# Altium schematic sheet Carrier Cancellation Circuit.SchDoc
size A4; SheetNumber: 4; SheetTotal: 10
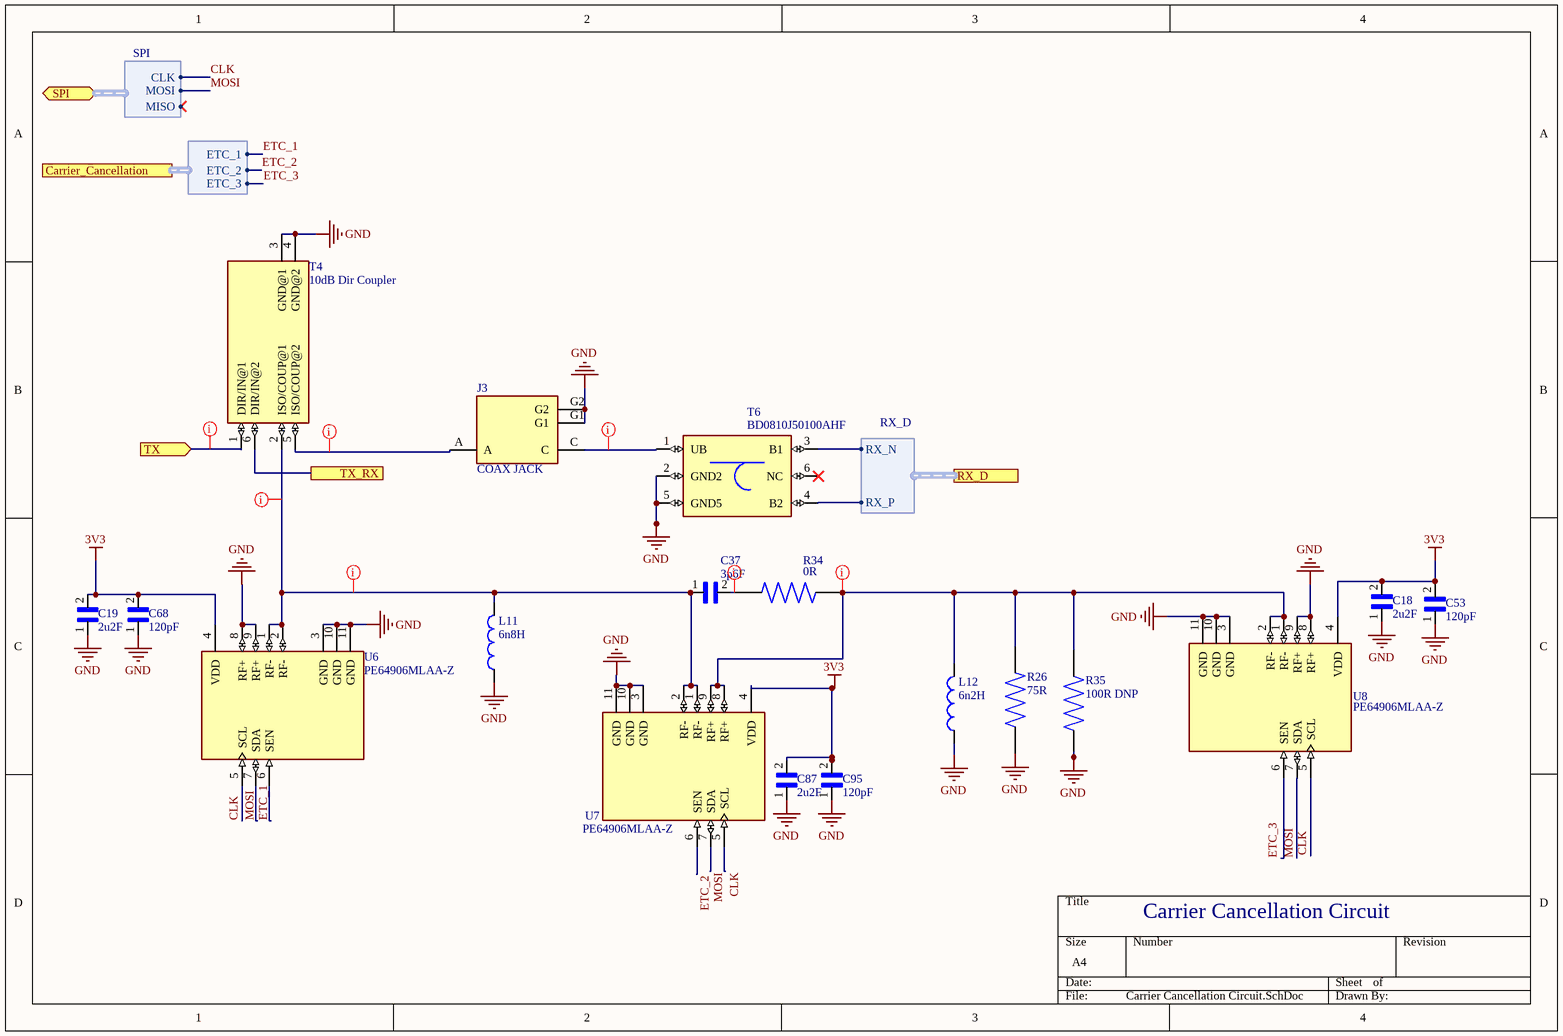
[diagram p0: Carrier Cancellation Circuit.SchDoc]

## Parts
C18  2u2F  [CAPC0603X35N]
C19  2u2F  [CAPC0603X35N]
C37  3p6F  [CAPC1005X55N]
C53  120pF  [CAPC0603X33N]
C68  120pF  [CAPC0603X33N]
C87  2u2F  [CAPC0603X35N]
C95  120pF  [CAPC0603X33N]
J3  COAX JACK  [SW_MS-156HF(01)]
L11  6n8H  [INDC1006X60N]
L12  6n2H  [INDC1006X60N]
R26  75R  [RES_ERJ2RKF75R0X]
R34  0R  [RESC1005X37N]
R35  100R DNP  [RES_ERJ2RKF75R0X]
T4  10dB Dir Coupler  [PSON65P164X204X84-6N]
T6  BD0810J50100AHF  [BD0810J50100AHF]
U6  PE64906MLAA-Z  [QFN50P200X200X60-11N]
U7  PE64906MLAA-Z  [QFN50P200X200X60-11N]
U8  PE64906MLAA-Z  [QFN50P200X200X60-11N]

## Ports
Carrier_Cancellation (harness Carrier_Cancellation, see System Overview[3A], External interfaces and connections[1A], Microcontroller[4B]), RX_D (harness RX_D, see System Overview[3A], UHF RFID READER IC[1D]), SPI (bidir, harness SPI, see System Overview[3A], External interfaces and connections[1A], Microcontroller[4A], UHF RFID READER IC[1A]), TX (in, see System Overview[3A], External Power Amplifier[4B]), TX_RX (see System Overview[3A], Antenna Switch[3B])

## Harnesses
SPI: CLK, MISO, MOSI
Carrier_Cancellation: ETC_1, ETC_2, ETC_3
RX_D: RX_N, RX_P

## Nets
3V3: C18.2 C19.2 C53.2 C68.2 C87.2 C95.2 U6.4(VDD) U7.4(VDD) U8.4(VDD)
GND: C18.1 C19.1 C53.1 C68.1 C87.1 C95.1 J3.G1 J3.G2 L11.1 L12.1 R26.1 R35.1 T4.3(GND@1) T4.4(GND@2) T6.2(GND2) T6.5(GND5) U6.3(GND) U6.8(RF+) U6.9(RF+) U6.10(GND) U6.11(GND) U7.3(GND) U7.10(GND) U7.11(GND) U8.3(GND) U8.8(RF+) U8.9(RF+) U8.10(GND) U8.11(GND)
CLK: U6.5(SCL) U7.5(SCL) U8.5(SCL) ; port SPI.CLK
ETC_1: U6.6(SEN) ; port Carrier_Cancellation.ETC_1
ETC_2: U7.6(SEN) ; port Carrier_Cancellation.ETC_2
ETC_3: U8.6(SEN) ; port Carrier_Cancellation.ETC_3
MOSI: U6.7(SDA) U7.7(SDA) U8.7(SDA) ; port SPI.MOSI
TX: T4.1(DIR/IN@1) ; port TX
TX_RX: T4.6(DIR/IN@2) ; port TX_RX
NetC37_1: C37.1 L11.2 T4.2(ISO/COUP@1) U6.1(RF-) U6.2(RF-) U7.1(RF-) U7.2(RF-)
NetC37_2: C37.2 R34.1
NetJ3_A: J3.A T4.5(ISO/COUP@2)
NetJ3_C: J3.C T6.1(UB)
NetL12_2: L12.2 R26.2 R34.2 R35.2 U7.8(RF+) U7.9(RF+) U8.1(RF-) U8.2(RF-)
NetT6_3: T6.3(B1) ; port RX_D.RX_N
NetT6_4: T6.4(B2) ; port RX_D.RX_P

Not connected (* = marked no-connect by the designer): T6 6(NC)*

## Layout directives
net class RF_50: NetC37_1, NetC37_2, NetJ3_A, NetJ3_C, NetL12_2, TX

## Notes on the sheet
- Carrier Cancellation Circuit

## Library data of the parts
C18 C19 C87 = GRM033R60J225ME15D: SMD Capacitor X5R(EIA) with Capacitance: 2.2uF Tol. 20%. Rated Voltage: 6.3Vdc; Package: None; Price: None; Value: *; MP: GRM033R60J225ME15D; Availability: Unavailable
C37 = GRM1555C1H3R6BA01D: SMD Capacitor C0G(EIA) with Capacitance: 3.6pF Tol. 0.1pF. Rated Voltage: 50Vdc; MF: Murata Electronics; MP: GRM1555C1H3R6BA01D; Availability: Warning; Price: None; SnapEDA_Link: https://www.snapeda.com/parts/GRM1555C1H3R6BA01D/Murata%20Electronics%20North%20America/view-part/1837607/?ref=snap; Purchase-URL: https://pricing.snapeda.com/search/part/GRM1555C1H3R6BA01D/?ref=eda; Value: *; Package: 1005 Taiyo Yuden
C53 C68 C95 = GRM0335C1H121JA01D: 0201 120 pF 50 V Â±5% Tolerance C0G SMT Multilayer Ceramic Capacitor; MF: Murata Electronics; Check_prices: https://www.snapeda.com/parts/GRM0335C1H121JA01D/Murata%20Electronics%20North%20America/view-part/1767262/?ref=eda; Value: *; Purchase-URL: https://pricing.snapeda.com/search/part/GRM0335C1H121JA01D/?ref=eda; Package: 0603 Taiyo Yuden; Price: None; MP: GRM0335C1H121JA01D; Availability: In Stock; SnapEDA_Link: https://www.snapeda.com/parts/GRM0335C1H121JA01D/Murata%20Electronics%20North%20America/view-part/1767262/?ref=snap
J3 = MS-156HF(01): Coaxial Switch - 4mm Plug Dia Connector Receptacle, Female Socket 50Ohm Surface Mount Solder; MF: Hirose Electric; Package: None; MP: MS-156HF(01); Value: *; SnapEDA_Link: https://www.snapeda.com/parts/MS-156HF(01)/Hirose%20Electric%20Co%20Ltd/view-part/1243878/?ref=snap; Price: None; Availability: Unavailable
L11 = LQW15AN6N8G00D: Inductor with Inductance: 6.8nH Tol. +/-2%, Package: 0402 (1005); MF: Murata; Package: 1006 Murata; DigiKey-Purchase-URL: https://snapeda.com/shop?store=DigiKey&id=555756; MP: LQW15AN6N8G00D; Mouser-Purchase-URL: https://snapeda.com/shop?store=Mouser&id=555756; Price: None; Availability: Good; Arrow_Electronics-Purchase-URL: https://snapeda.com/shop?store=Arrow+Electronics&id=555756; Value: *; SnapEDA_Link: https://www.snapeda.com/parts/LQW15AN6N8G00D/Murata%20Electronics%20North%20America/view-part/555756/?ref=snap
L12 = LQW15AN5N6C10D: Ind RF Chip Wirewound 5.6nH 0.2nH 100MHz 30Q-Factor 800mA 0402 Paper T/R; Package: None; Price: None; Value: *; MP: LQW15AN5N6C10D; Availability: Unavailable
R26 R35 = ERJ2RKF75R0X: Availability: Unavailable; Value: *; Package: None; Price: None; MP: ERJ2RKF75R0X
R34 = RC0402JR-070RL: MF: {'manufacturer': u'YAGEO'}; Package: None; Price: None; Value: *; MP: RC0402JR-070RL; Availability: Unavailable
T4 = DC0710J5010AHF: RF Directional Coupler General Purpose 700MHz ~ 1GHz 10.9dB 2W 0805 (2012 Metric); MF: Anaren; SnapEDA_Link: https://www.snapeda.com/parts/DC0710J5010AHF/Anaren/view-part/480146/?ref=snap; Value: *; Price: None; Availability: Good; Mouser-Purchase-URL: https://snapeda.com/shop?store=Mouser&id=480146; MP: DC0710J5010AHF; Package: 0805 Anaren Microwave; DigiKey-Purchase-URL: https://snapeda.com/shop?store=DigiKey&id=480146
T6 = BD0810J50100AHF: Signal Conditioning 800-1000MHz 50/100 Ohm IL=.95dB; MF: ttm technologies; SnapEDA_Link: https://www.snapeda.com/parts/BD0810J50100AHF/LM+Technologies/view-part/?ref=snap; Package: None; Value: *; MP: BD0810J50100AHF; Check_prices: https://www.snapeda.com/parts/BD0810J50100AHF/LM+Technologies/view-part/?ref=eda
U6-U8 = PE64906MLAA-Z: Murata Digitally Tunable Capacitor (100-3000 MHz) 0.9-4.6pF, SPI Interface; MF: pSemi; MP: PE64906MLAA-Z; Availability: Bad; SnapEDA_Link: https://www.snapeda.com/parts/PE64906MLAA-Z/pSemi/view-part/4991719/?ref=snap; Package: None; Price: None; Value: *